# EAGLE board Flight Controller (EAGLE 8.2.2)
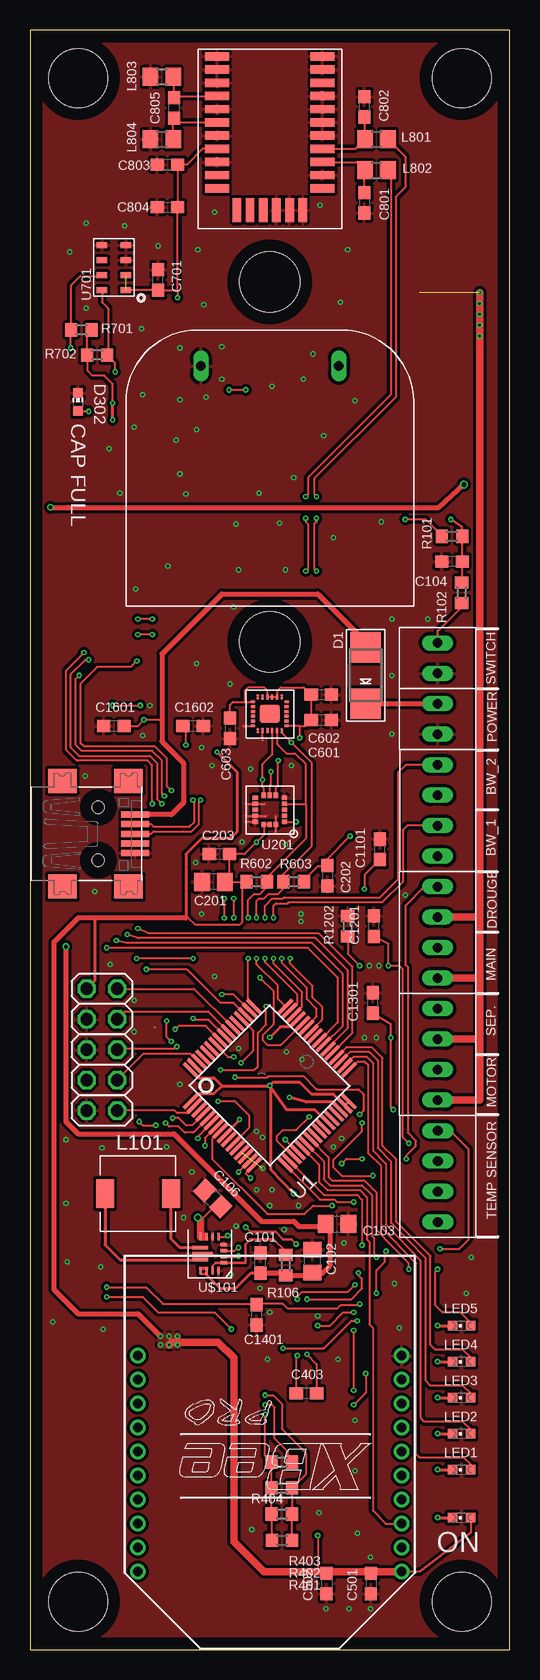
[diagram p15: board, top side]
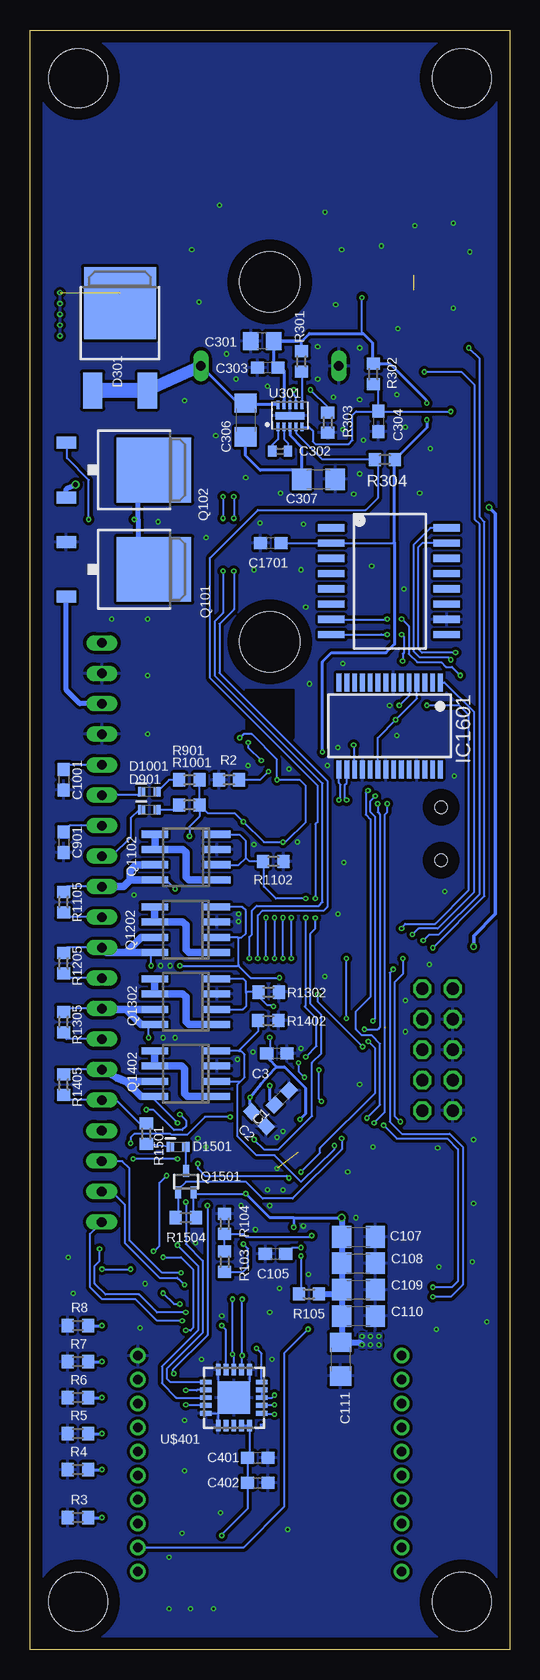
[diagram p16: board, bottom side, seen from below]

Size 40 x 135 mm. Coordinates in mm from the lower left corner, seen from the top.
Outline: 0,0 40,0 40,135 0,135 0,0
Copper layers (1*16): Top 0.035mm / dielectric 1.5mm / Bottom 0.035mm
Design rules "default *": minimum track width 7mil, minimum drill 7mil, track to track 7mil, track to pad 7mil, pad to pad 7mil, via to via 7mil, smd to smd 7mil, copper to edge 40mil, drill to drill 8mil, minimum pad ring 10mil, minimum via ring 5mil, stop-mask expansion 4mil, vias tented up to drill 0mil, thermal gap 10mil
Net classes: 0 default: clearance 0.205 mm; 1 signals: width 0.13 mm, clearance 0.205 mm
Holes 4.9 mm at 4,131 36,4 4,4 36,131
Holes 5 mm at 20,84 20,114
tKeepout: area 13,104.9 to 15.5,109.2; area 24.5,104.9 to 27,109.2
bKeepout: area 13,104.9 to 15.5,109.2; area 24.5,104.9 to 27,109.2

## Footprints (pad centres in the part's own frame; a part is rotated, then mirrored left to right if it is on the bottom)
C0603 = smd 1.1 x 1: 1 -0.85,0; 2 0.85,0
C0805 = smd 1.3 x 1.5: 1 -0.95,0; 2 0.95,0
C1206 = smd 1.6 x 1.8: 1 -1.4,0; 2 1.4,0
C0402 = smd 0.7 x 0.9: 1 -0.65,0; 2 0.65,0
AVX_1F_5V_FOLDED = drill 0.8 long: 1 -5.75,0; 2 5.75,0
USB-MINIB = smd 0.5 x 2.308: D+ 0,4.064; D- -0.8,4.064; GND 1.6,4.064; ID 0.8,4.064; VBUS -1.6,4.064 | smd 2 x 2.4: GND1 -4.4,-2; GND2 -4.4,3.5; GND3 4.4,3.5; GND4 4.4,-2 | hole 1: -2.2,1; 2.2,1
SMADIODE = smd 2.54 x 2.54: A 2.349,0; C -2.349,0
TO252 = smd 1.6 x 3: 1 -2.28,-4.8; 2 2.28,-4.8 | smd 6 x 6: 3 0,2.5
CHIP-LED0603 = smd 0.8 x 0.8: A 0,-0.75; C 0,0.75
SOD523 = smd 0.6 x 0.8: A 0.7,0; C -0.6,0
SSOP28 = smd 0.4 x 1.5: 1 -4.225,-3.625; 2 -3.575,-3.625; 3 -2.925,-3.625; 4 -2.275,-3.625; 5 -1.625,-3.625; 6 -0.975,-3.625; 7 -0.325,-3.625; 8 0.325,-3.625; 9 0.975,-3.625; 10 1.625,-3.625; 11 2.275,-3.625; 12 2.925,-3.625; 13 3.575,-3.625; 14 4.225,-3.625; 15 4.225,3.625; 16 3.575,3.625; 17 2.925,3.625; 18 2.275,3.625; 19 1.625,3.625; 20 0.975,3.625; 21 0.325,3.625; 22 -0.325,3.625; 23 -0.975,3.625; 24 -1.625,3.625; 25 -2.275,3.625; 26 -2.925,3.625; 27 -3.575,3.625; 28 -4.225,3.625
2POS_0.1 = drill 0.8 long: 1 -1.27,0; 2 1.27,0
4POS_0.1 = drill 0.8 long: 1 -3.81,0; 2 -1.27,0; 3 1.27,0; 4 3.81,0
2X05 = drill 1.016 octagon: 1 -5.08,-1.27; 2 -5.08,1.27; 3 -2.54,-1.27; 4 -2.54,1.27; 5 0,-1.27; 6 0,1.27; 7 2.54,-1.27; 8 2.54,1.27; 9 5.08,-1.27; 10 5.08,1.27
B82462G4 = smd 1.5 x 2.4: P$1 -2.75,0; P$2 2.75,0
R0805 = smd 1.3 x 1.5: 1 -0.95,0; 2 0.95,0
CHIPLED_0603 = smd 0.8 x 0.8: A 0,-0.75; C 0,0.75
TO252' = smd 1 x 1.6: 1 -2.28,-4.8; 2 2.28,-4.8 | smd 5.4 x 6.2: 3 0,2.5
SO-08 = smd 0.6 x 2.2: 1 -1.905,-2.6; 2 -0.635,-2.6; 3 0.635,-2.6; 4 1.905,-2.6; 5 1.905,2.6; 6 0.635,2.6; 7 -0.635,2.6; 8 -1.905,2.6
SOT323 = smd 0.5 x 1: 1 0,0.9; 2 -0.65,-0.9; 3 0.65,-0.9
R0603 = smd 1 x 1.1: 1 -0.85,0; 2 0.85,0
SQFP-S-10X10-64 = smd 1.6 x 0.3: 1 -5.6,3.75; 2 -5.6,3.25; 3 -5.6,2.75; 4 -5.6,2.25; 5 -5.6,1.75; 6 -5.6,1.25; 7 -5.6,0.75; 8 -5.6,0.25; 9 -5.6,-0.25; 10 -5.6,-0.75; 11 -5.6,-1.25; 12 -5.6,-1.75; 13 -5.6,-2.25; 14 -5.6,-2.75; 15 -5.6,-3.25; 16 -5.6,-3.75; 33 5.6,-3.75; 34 5.6,-3.25; 35 5.6,-2.75; 36 5.6,-2.25; 37 5.6,-1.75; 38 5.6,-1.25; 39 5.6,-0.75; 40 5.6,-0.25; 41 5.6,0.25; 42 5.6,0.75; 43 5.6,1.25; 44 5.6,1.75; 45 5.6,2.25; 46 5.6,2.75; 47 5.6,3.25; 48 5.6,3.75 | smd 0.3 x 1.6: 17 -3.75,-5.6; 18 -3.25,-5.6; 19 -2.75,-5.6; 20 -2.25,-5.6; 21 -1.75,-5.6; 22 -1.25,-5.6; 23 -0.75,-5.6; 24 -0.25,-5.6; 25 0.25,-5.6; 26 0.75,-5.6; 27 1.25,-5.6; 28 1.75,-5.6; 29 2.25,-5.6; 30 2.75,-5.6; 31 3.25,-5.6; 32 3.75,-5.6; 49 3.75,5.6; 50 3.25,5.6; 51 2.75,5.6; 52 2.25,5.6; 53 1.75,5.6; 54 1.25,5.6; 55 0.75,5.6; 56 0.25,5.6; 57 -0.25,5.6; 58 -0.75,5.6; 59 -1.25,5.6; 60 -1.75,5.6; 61 -2.25,5.6; 62 -2.75,5.6; 63 -3.25,5.6; 64 -3.75,5.6
TFLGA16L = smd 0.45 x 0.35: P1 -1.225,1; P2 -1.225,0.5; P3 -1.225,0; P4 -1.225,-0.5; P5 -1.225,-1; P9 1.225,-1; P10 1.225,-0.5; P11 1.225,0; P12 1.225,0.5; P13 1.225,1 | smd 0.35 x 0.45: P6 -0.5,-1.225; P7 0,-1.225; P8 0.5,-1.225; P14 0.5,1.225; P15 0,1.225; P16 -0.5,1.225
DFN10-2X3 = smd 0.25 x 0.7: P1 -2,-1.85; P2 -1.5,-1.85; P3 -1,-1.85; P4 -0.5,-1.85; P5 0,-1.85; P6 0,0; P7 -0.5,0; P8 -1,0; P9 -1.5,0; P10 -2,0 | smd 2.39 x 0.64: P11 -1,-0.925
QFN-24 = smd 0.4 x 0.2: 1 -1.4,1; 2 -1.4,0.6; 3 -1.4,0.2; 4 -1.4,-0.2; 5 -1.4,-0.6; 6 -1.4,-1; 13 1.4,-1; 14 1.4,-0.6; 15 1.4,-0.2; 16 1.4,0.2; 17 1.4,0.6; 18 1.4,1 | smd 0.2 x 0.4: 7 -1,-1.4; 8 -0.6,-1.4; 9 -0.2,-1.4; 10 0.2,-1.4; 11 0.6,-1.4; 12 1,-1.4; 19 1,1.4; 20 0.6,1.4; 21 0.2,1.4; 22 -0.2,1.4; 23 -0.6,1.4; 24 -1,1.4 | smd 1.7 x 1.54: PAD 0,0
MS5611 = smd 0.9 x 0.5: 1 0,0; 2 0,-1.25; 3 0,-2.5; 4 0,-3.75; 5 2,-3.75; 6 2,-2.5; 7 2,-1.25; 8 2,0
SOP16 = smd 0.6 x 2.2: 1 -4.445,-4.87; 2 -3.175,-4.87; 3 -1.905,-4.87; 4 -0.635,-4.87; 5 0.635,-4.87; 6 1.905,-4.87; 7 3.175,-4.87; 8 4.445,-4.87; 9 4.445,4.743; 10 3.175,4.743; 11 1.905,4.743; 12 0.635,4.743; 13 -0.635,4.743; 14 -1.905,4.743; 15 -3.175,4.743; 16 -4.445,4.743
VQFN15_2.5X3 = smd 0.6 x 0.25: P1 -1.15,0.75; P2 -1.15,0.25; P3 -1.15,-0.25; P4 -1.15,-0.75 | smd 0.25 x 0.6: P5 -0.725,-1.4; P6 -0.225,-1.4; P7 0.275,-1.4; P8 0.775,-1.4; P12 0.775,1.4; P13 0.27,1.4; P14 -0.225,1.4; P15 -0.725,1.4 | smd 1.35 x 0.25: P9 0.775,-0.5; P11 0.775,0.5 | smd 1.7 x 0.25: P10 0.6,0
TQFN20-5X5 = smd 0.95 x 0.4: 1 -2.325,1.3; 2 -2.325,0.65; 3 -2.325,0; 4 -2.325,-0.65; 5 -2.325,-1.3; 11 2.325,-1.3; 12 2.325,-0.65; 13 2.325,0; 14 2.325,0.65; 15 2.325,1.3 | smd 0.4 x 0.95: 6 -1.3,-2.325; 7 -0.65,-2.325; 8 0,-2.325; 9 0.65,-2.325; 10 1.3,-2.325; 16 1.3,2.325; 17 0.65,2.325; 18 0,2.325; 19 -0.65,2.325; 20 -1.3,2.325 | smd 2.7 x 2.7: EXP 0,0
M10478-A3 = smd 2 x 0.7: 1 -4.4,12.8; 2 -4.4,11.7; 3 -4.4,10.6; 4 -4.4,9.5; 5 -4.4,8.4; 6 -4.4,7.3; 7 -4.4,6.2; 8 -4.4,5.1; 9 -4.4,4; 10 -4.4,2.9; 11 -4.4,1.8; 18 4.4,1.8; 19 4.4,2.9; 20 4.4,4; 21 4.4,5.1; 22 4.4,6.2; 23 4.4,7.3; 24 4.4,8.4; 25 4.4,9.5; 26 4.4,10.6; 27 4.4,11.7; 28 4.4,12.8 | smd 0.7 x 2: 12 -2.75,0; 13 -1.65,0; 14 -0.55,0; 15 0.55,0; 16 1.65,0; 17 2.75,0
XBEE-PRO = drill 0.8 pad 1.27: 1 -11,9; 2 -11,7; 3 -11,5; 4 -11,3; 5 -11,1; 6 -11,-1; 7 -11,-3; 8 -11,-5; 9 -11,-7; 10 -11,-9; 11 11,-9; 12 11,-7; 13 11,-5; 14 11,-3; 15 11,-1; 16 11,1; 17 11,3; 18 11,5; 19 11,7; 20 11,9

## Placement (x,y rotation side)
C1  4.7u  [C0603]  19,46 45 bottom
C2  1u  [C0603]  20.9,44.2 135 bottom
C3  100n  [C0603]  19.4,49.69 180 bottom
C101  10u  [C0603]  19.21,32.22 90 top
C102  10u  [C0805]  23.55,32.37 90 top
C103  10u  [C0805]  25.61,35.47 0 top
C104  2.2 u  [C0603]  35.2,90.7 180 top
C105  100n  [C0603]  19.52,32.96 180 bottom
C106  10u  [C0805]  15.25,37.59 135 top
C107  22u  [C1206]  12.6,34.4 0 bottom
C108  22u  [C1206]  12.6,32.2 0 bottom
C109  22u  [C1206]  12.6,30 0 bottom
C110  22u  [C1206]  12.6,27.8 0 bottom
C111  22u  [C1206]  14.09,24.2 270 bottom
C201  10u  [C0805]  15.3,64 180 top
C202  0.1u  [C0603]  24.8,64.5 270 top
C203  0.1u  [C0603]  15.8,66.3 180 top
C301  2.2u  [C0805]  20.62,109.07 180 bottom
C302  1u  [C0402]  19.13,99.89 0 bottom
C303  1u  [C0603]  20.17,106.84 180 bottom
C304  0.1u  [C0603]  10.94,102.38 270 bottom
C305  [AVX_1F_5V_FOLDED]  20,107 180 top
C306  100u  [C1206]  22.02,102.49 270 bottom
C307  100u  [C1206]  15.94,97.55 0 bottom
C401  0.1 u  [C0603]  21,16 0 bottom
C402  0.1 u  [C0603]  21,13.9 0 bottom
C403  100 n  [C0603]  23.06,21.37 0 top
C501  0.1u  [C0603]  28.44,5.5 270 top
C502  1u  [C0603]  24.74,5.5 270 top
C601  0.1u  [C0603]  24.3,77.5 0 top
C602  10n  [C0603]  24.3,79.6 0 top
C603  0.1u  [C0603]  16.68,76.79 270 top
C701  100n  [C0603]  10.69,114.17 90 top
C801  22p  [C0603]  27.9,120.6 270 top
C802  22p  [C0603]  27.9,128.6 90 top
C803  22p  [C0603]  11.47,123.79 0 top
C804  2.2u  [C0603]  11.47,120.22 0 top
C805  18p  [C0603]  12,128.5 270 top
C901  0.1u  [C0603]  37.2,67.3 270 bottom
C1001  0.1u  [C0603]  37.2,72.5 270 bottom
C1101  0.1u  [C0603]  29.2,66.7 90 top
C1201  0.1u  [C0603]  28.7,60.3 90 top
C1301  0.1u  [C0603]  28.6,53.9 90 top
C1401  0.1u  [C0603]  18.9,27.9 270 top
C1601  0.1u  [C0603]  7,77 0 top
C1602  0.1u  [C0603]  13.6,77 0 top
C1701  0.1u  [C0603]  19.91,92.22 180 bottom
CN1  [USB-MINIB]  4.7,68 270 top
D1  B160-13-F  [SMADIODE]  28,81.2 90 top
D301  RB095BM-30  [TO252]  32.49,109.74 0 bottom
D302  LTST-C193KRKT-2A  [CHIP-LED0603]  4,104 0 top
D901  CES521SOD523  [SOD523]  30.1,70 0 bottom
D1001  CES521SOD523  [SOD523]  30.1,71.5 0 bottom
D1501  CES521SOD523  [SOD523]  27.7,41.9 0 bottom
IC1601  FT232RL  [SSOP28]  10,77 180 bottom
J1  2POS_SCREWTERM  [2POS_0.1]  34,77.57 270 top
J2  4POS_SCREWTERM  [4POS_0.1]  34.02,39.44 90 top
J3  4POS_SCREWTERM  [4POS_0.1]  34,49.61 90 top
J4  4POS_SCREWTERM  [4POS_0.1]  34,59.78 90 top
J5  4POS_SCREWTERM  [4POS_0.1]  34.01,69.94 90 top
J101  2POS_SCREWTERM  [2POS_0.1]  34,82.64 90 top
JP1  [2X05]  6,50 270 top
L101  B82462G4102M  [B82462G4]  9,38 0 top
L801  47n  [R0805]  28.9,125.9 0 top
L802  47n  [R0805]  28.9,123.3 0 top
L803  2.2u  [R0805]  11,131.1 0 top
L804  2.2u  [R0805]  11,125.9 0 top
LED1  BLUE  [CHIPLED_0603]  36,15 90 top
LED2  BLUE  [CHIPLED_0603]  36,18 90 top
LED3  BLUE  [CHIPLED_0603]  36,21 90 top
LED4  BLUE  [CHIPLED_0603]  36,24 90 top
LED5  BLUE  [CHIPLED_0603]  36,27 90 top
ON  RED  [CHIPLED_0603]  36,11 90 top
Q101  IPD042P03L3G  [TO252']  32.16,90.05 270 bottom
Q102  IPD042P03L3G  [TO252']  32.16,98.32 270 bottom
Q1102  DMG4800LSD  [SO-08]  26.98,66.05 90 bottom
Q1202  DMG4800LSD  [SO-08]  27,60 90 bottom
Q1302  DMG4800LSD  [SO-08]  27,54 90 bottom
Q1402  DMG4800LSD  [SO-08]  27,48 90 bottom
Q1501  PMF170XP  [SOT323]  27,39 0 bottom
R2  10k  [R0603]  23.4,72.5 0 bottom
R3  [R0603]  36,11 0 bottom
R4  [R0603]  36,15 0 bottom
R5  [R0603]  36,18 0 bottom
R6  [R0603]  36,21 0 bottom
R7  [R0603]  36,24 0 bottom
R8  [R0603]  36,27 0 bottom
R101  100k  [R0603]  35.2,92.8 180 top
R102  1k  [R0603]  36,88.1 270 top
R103  470k  [R0603]  23.76,32.32 270 bottom
R104  150k  [R0603]  23.76,35.48 270 bottom
R105  100k  [R0603]  16.73,29.64 0 bottom
R106  10k  [R0603]  21.34,32.03 270 top
R301  10k  [R0603]  17.36,107.37 90 bottom
R302  2.2k  [R0603]  11.36,106.32 90 bottom
R303  12k  [R0603]  15.16,102.27 90 bottom
R304  10k  [R0603]  10.4,99.2 0 bottom
R401  1.2 k  [R0603]  21.02,9.1 180 top
R402  1.2 k  [R0603]  21.01,11.3 180 top
R403  1.2 k  [R0603]  21.01,13.47 180 top
R404  10 M  [R0603]  21.01,15.62 180 top
R602  2.2K  [R0603]  18.9,64 180 top
R603  2.2K  [R0603]  22,64 0 top
R701  2.2k  [R0603]  4.3,110 0 top
R702  2.2k  [R0603]  5.6,107.9 180 top
R901  10k  [R0603]  26.7,70.4 0 bottom
R1001  10k  [R0603]  26.7,72.5 0 bottom
R1102  10 k  [R0603]  19.7,65.7 180 bottom
R1105  1M  [R0603]  37.2,62.3 270 bottom
R1202  10 k  [R0603]  26.5,60.3 270 top
R1205  1M  [R0603]  37.2,57.2 270 bottom
R1302  10 k  [R0603]  20.1,54.8 180 bottom
R1305  1M  [R0603]  37.2,52.3 270 bottom
R1402  10 k  [R0603]  20.11,52.43 180 bottom
R1405  1M  [R0603]  37.2,47.1 270 bottom
R1501  10 k  [R0603]  30.3,43 270 bottom
R1504  10 k  [R0603]  27,36 0 bottom
U1  G55J19  [SQFP-S-10X10-64]  20,47 45 top
U201  HDLIS100DL  [TFLGA16L]  20,70 180 top
U301  LTC3225  [DFN10-2X3]  17.31,103.76 0 bottom
U601  MPU9250  [QFN-24]  20,78 180 top
U701  MS5611  [MS5611]  8,113.3 180 top
U1701  MT29F1G01  [SOP16]  9.99,89.05 270 bottom
U$101  TPS6307X  [VQFN15_2.5X3]  15,33 180 top
U$401  MAX31865  [TQFN20-5X5]  23,21 180 bottom
U$801  [M10478-A3]  20,120 0 top
XB501  XBEE-PRO  [XBEE-PRO]  20,15.5 180 top

## Tracks (layer width: path | path; a pad name or v marks a point on that pad's centre or on a via)
+3V3  (via drill 0.18, 0.4)  (1 unrouted)
  Top 0.152: C106.1 15.44,36.99 14.22,35.77
  Top 0.178: 23,77 23.45,77.45 C601.1
  Top 0.18: U$801.8 14.4,125.1 13.09,123.79 C803.2 C804.2 12.3,120.2 12.3,113.3 | U201.P15 U201.P14 19.5,67.9 v18.9,67.3 17.9,66.3 C203.1 16.65,64.4 C201.1 R602.2 17.67,63.62 17.67,60.6 17.47,60.4 13.8,60.4 13.2,61 12.98,61 | U201.P1 v22.2,69 | 22.47,77 23,77 | 22.47,77 U601.1 | U601.22 20.2,74.6 19.4,73.8 v19.4,72.5 19.4,71.9 19.5,71.8 U201.P8 | 17.93,79 U601.13 | 12.3,113.3 v12.3,112.7 | C601.1 C602.1 22.85,80.2 20.9,80.2 20.6,79.9 U601.8 U601.9 U601.10 19.8,79.95 19.55,80.2 18.2,80.2 17.9,79.9 17.9,79.03 17.93,79 | v22.5,76 22.5,76.97 22.47,77 | C603.1 16.68,78.75 16.93,79 17.93,79 | ON.A 36.75,9.75 32.5,6.5 XB501.1 | C502.1 24.89,6.5 | C501.1 28.29,6.5 | R603.2 22.85,64.15 24,65.3 24.75,65.3 C202.1 24.8,65.9 v26.7,67.8 | v24,9.5 24,6.61 24.11,6.5 | U701.1 10.67,113.3 C701.1 12.28,113.32 12.3,113.3 | R701.2 4.75,109.6 R702.2 4.8,107.85 4.8,106.6 5.2,106.2 6.2,106.2 6.9,105.5 v6.9,103.9
  Top 0.203: v22.2,33.8 21.8,34.2 21.1,34.2 20.5,34.8 18.4,34.8 v18,35.2
  Top 0.254: U$101.P8 U$101.P7 14.72,34.5 14.22,35 | 24.84,43.94 U1.27 24.83,43.92 23.77,44.98 21.42,44.98 20.07,46.9 | U1.32 U1.31 25.32,46.28 23.51,46.28 22.5,47.29 20.29,47.29 v20,47 | U1.64 13.41,48.31 14.06,47.66 15.34,47.66 16,47 | 16,47 v20,47 | U1.1 13.41,45.69 14.06,46.34 15.34,46.34 16,47 | 20.07,46.9 v20,47 | v22,38 20.1,40 20.1,46.87 20.07,46.9 | v14,36 14.22,36 | v6.9,102.5 v6.9,103.9 | v15.6,74.8 17.3,73.1 17.3,68.2 16.7,67.6 14.3,67.6 13,66.3 13,61.02 12.98,61 | 5.35,61 5.4,60.95 5.4,55.75 JP1.1
  Top 0.406: 13.02,61 12.98,61 5.35,61 4,61 2,59 2,30 4,28 9,28 v10.9,26.1
  Top 0.61: XB501.1 28.29,6.5 24.89,6.5 24.11,6.5 19.5,6.5 17,9 17,24.3 15.7,25.6 11.8,25.6 v11.6,25.4 | U$101.P8 14.22,35 14.22,35.77 v14,36
  Bottom 0.18: 6.9,104.1 v6.9,103.9 | R1504.2 26.35,36.2 Q1501.3 26.25,38 v22,38 | 12.2,109.7 12.3,109.8 v12.3,112.7 | v22.5,76 22.2,76.3 21.5,76.3 19.4,74.2 v19.4,72.5 17.5,72.5 17,72 17,69 18.7,67.3 v18.9,67.3 20.5,67.3 v22.2,69 22.9,69.7 25.15,69.7 R901.2 | C1701.1 U1701.2 9.65,92.22 9.6,92.27 | R901.2 R1001.2 | R103.2 22.23,31.47 21.8,31.9 21.8,33.4 v22.2,33.8 | U$401.19 U$401.20 | U$401.20 21.68,18.68 | U$401.20 21.7,16.15 C401.1 C402.1 21.85,11.75 24,9.6 v24,9.5 | R901.2 25.85,69.45 26.7,68.6 v26.7,67.8
  Bottom 0.203: v18,35.2 18,35.99 18.01,36
  Bottom 0.254: v20,47 20,45.8 C1.1 | v14,36 18.01,36 20,36 v22,38 | C301.1 19.67,107.19 C303.1 19.06,106.84 18.81,106.59 U301.P9 | C301.1 17.61,109.07 | R301.2 17.36,108.82 17.36,109.07 | 17.36,109.07 C301.1 | 17.36,109.07 17.33,109.07 16.7,109.7 12.2,109.7 11.4,108.9 11.4,107.21 R302.2 9.97,107.17 6.9,104.1 | v6.9,102.5 6.9,101.85 R304.2 9.6,99.15 9.6,92.27 9.6,83.8 10.3,83.1 14.85,83.1 15.6,82.35 v15.6,74.8 | JP1.1 4.73,55.13
  Bottom 0.508: v14,36 C107.1 C108.1 C109.1 14,29.68 | 14,29.68 C110.1 14,25.69 C111.1 12.5,25.6 v12.3,25.4 | R105.2 14.04,29.64 14,29.68
  other vias: 11.6,26.1 12.3,26.1 10.9,25.4
  pour Top: 10.6,26.4 10.6,25.1 12.6,25.1 12.6,26.4
  pour Bottom: 12.6,26.4 12.6,25.1 10.6,25.1 10.6,26.4
+5V  (via drill 0.18)
  Top 0.178: C1601.2 9,77 v9.5,77.5
  Top 0.18: v9.5,77.5 10.96,77.5 11,77.47
  Top 0.406: CN1.VBUS 11.8,69.6 12.8,70.6 12.8,73.9 11,75.7 11,77.47 11,83 16,88 24,88 28,84 D1.A
  Bottom 0.178: IC1601.20 11,73.4 11,76 v9.5,77.5 7.72,79.28 IC1601.4
  Bottom 0.18: 11,73.35 IC1601.20
BREAKWIRE1:N$1
  Bottom 0.18: R901.1 27.95,70 D901.A
BREAKWIRE2:N$1
  Bottom 0.18: R1001.1 28.4,72.5 D1001.A
BW1_STATUS  (via drill 0.18)
  Top 0.18: U1.46 22.7,53.59 22.7,54.8 20.3,57.2 v20.3,57.6 | J5.2 31.47,68.67 31.1,68.3 31.1,64 29.4,62.3 21.6,62.3 21.5,62.2 20.5,62.2 20.3,62 v20.3,61
  Bottom 0.18: J5.2 36.68,68.67 C901.1 | v20.3,57.6 v20.3,61
BW2_STATUS  (via drill 0.18)
  Top 0.18: U1.47 22.3,53.9 22.3,54.6 19.6,57.3 v19.6,57.6 | J5.4 31.35,73.75 30.7,73.1 30.7,64.2 29.2,62.7 21.2,62.7 21.1,62.6 20.2,62.6 19.6,62 v19.6,61
  Bottom 0.18: J5.4 36.8,73.75 C1001.1 | v19.6,61 v19.6,57.6
C4:N$2
  Bottom 0.18: Q1501.1 D1501.A
C4:N$3
  Bottom 0.18: D1501.C 30.25,42.1 R1501.2
DCDC_REGULATOR:N$1  (via drill 0.18)
  Top 0.18: R101.2 34.35,92.85 33,94.2 v31.3,94.2
  Bottom 0.18: 31,95.88 Q102.3 | 31,92.39 Q101.3 | v31.3,94.2 31.02,94.2 31,94.22
  Bottom 0.406: 31,95.88 31,94.22 31,92.39
DCDC_REGULATOR:N$3
  Top 0.254: U$101.P11 7.5,32.5 6.25,33.75 L101.P$1
DCDC_REGULATOR:N$4  (via drill 0.18)
  Top 0.18: R102.1 36.05,89 C104.1 R101.1 36.05,93.55 v35.1,94.2
  Bottom 0.18: Q102.1 36.9,100.54 36.9,99.3 35.1,97.5 v35.1,94.2
DCDC_REGULATOR:N$5
  Top 0.254: L101.P$2 11.75,34.25 12.5,33.5 U$101.P9
DCDC_REGULATOR:N$6
  Top 0.18: J101.2 34,84.9 36,86.9 R102.2
DCDC_REGULATOR:N$7  (via drill 0.18)
  Top 0.18: U$101.P3 17.05,33.25 17.3,33.5 v17.4,33.5
  Bottom 0.18: v17.4,33.5 18.13,33.5 C105.1
DCDC_REGULATOR:N$9  (via drill 0.18)
  Top 0.18: U$101.P2 17.35,32.75 v17.4,32.8
  Bottom 0.18: v17.4,32.8 17.4,29.76 R105.1
DCDC_REGULATOR:N$10  (via drill 0.18)
  Top 0.18: U$101.P5 16.4,34.4 v16.5,34.5
  Bottom 0.18: R103.1 R104.2 22.23,34.63 22,34.4 16.6,34.4 v16.5,34.5
DCDC_REGULATOR:N$11
  Top 0.203: 20.32,34.2 21.34,33.18 R106.1
  Top 0.21: U$101.P14 15.22,31.98 15.49,32.25 U$101.P1 17.96,32.25 17.96,33.79 18.37,34.2 20.32,34.2
DCDC_REGULATOR:VIN  (via drill 0.3, 0.4)
  Top 0.18: 14.25,31.32 14.63,31.32 14.73,31.42 U$101.P13 | 14.25,31.32 14.22,31.32 | U$101.P12 14.22,31.35 14.25,31.32
  Top 0.254: C101.1 18.41,31.37 17.11,30.07 15.88,30.07 14.63,31.32
  Top 0.406: C101.1 20.93,31.37 R106.2 23.31,31.18 C102.1 | C102.1 23.19,31.38 | C102.1 24.32,31.32 25,32 25,35.17 24.96,35.17 24.87,35.26 | 24.54,35.63 C103.1 24.87,35.26 | v36.2,97.1 34.1,95.2 3.2,95.2 v1.7,95.2 | v3,58.6 3,44 4,43 12,43 19.3,35.7 22,35.7 22.44,35.26 24.87,35.26
  Bottom 0.305: v3,58.6 3,59.5 1.2,61.3 1.2,94.7 v1.7,95.2
  Bottom 0.406: Q102.2 36.96,96.76 36.9,96.8 v36.2,97.1
FC1-  (via drill 0.18)
  Top 0.18: v27.7,43.9 27.7,43.2 25.3,40.8 25.3,40.2 26,39.5 v28.6,39.5 | U1.56 16.22,51.18 14.9,52.5 13.7,52.5 v13.6,52.6 | v13.6,57.6 v8.9,57.6 | v9.1,44 9.4,43.7 v10.5,43.7 | v6.4,30.2 9.7,30.2 11.1,28.8 18.85,28.8 C1401.1 18.95,28.8 21.1,28.8 21.5,28.4 25.6,28.4 25.9,28.7 27.4,28.7 v27.5,28.8 | v28.9,29.7 28.9,31.6 29.6,32.3 29.6,33.1 v29.7,33.2
  Bottom 0.18: J3.2 36.95,48.34 37.2,48.09 | Q1402.8 29.6,45.8 v27.7,43.9 | v8.9,57.6 8.9,56.3 9.6,55.6 9.6,44.5 v9.1,44 | v13.6,52.6 v13.6,57.6 | v10.5,43.7 9.4,42.6 5.2,42.6 4.3,41.7 4.3,30.7 4.8,30.2 v6.4,30.2 | v27.5,28.8 28,28.8 v28.9,29.7 | v28.6,39.5 29.2,38.9 29.2,33.66 29.66,33.2 v29.7,33.2
  Bottom 0.2: 37.2,48.09 R1405.1
  Bottom 0.61: 32,47.37 Q1402.7 | 32,47.37 32.73,47.66 J3.2 | Q1402.8 30.73,46.09 32,47.37
FC1_FIRE  (via drill 0.18)
  Top 0.18: U1.7 14.6,42.66 v14.6,42
  Bottom 0.18: Q1402.2 22.43,47.37 | 22.43,47.37 22.1,47.7 22.1,49.6 22.4,49.9 22.6,49.9 | 22.6,49.9 Q1402.4 | 22.43,47.37 22.7,47.1 22.7,42.78 21.12,41.2 19.6,41.2 17.4,39 14.6,41.7 v14.6,42 | 22.6,49.9 20.96,51.54 R1402.2
FC2-  (via drill 0.18)
  Top 0.18: C1301.1 30.1,52.15 v30.1,51 30.1,45.2 v30.3,45 | U1.52 17.65,52.55 18.6,51.6 18.6,49.9 v17.6,48.9 | v17.1,47.7 19.8,47.7 19.9,47.8 22.8,47.8 23.9,46.7 27.4,46.7 27.8,46.3 27.8,44.9 v27.5,44.6
  Bottom 0.18: J3.4 36.95,53.42 | v30.1,51 v30.11,51.01 30.11,52.09 | v17.6,48.9 17.6,48.2 v17.1,47.7 | v27.5,44.6 27,44.1 27,43.6 27.3,43.3 28,43.3 29.7,45 v30.3,45
  Bottom 0.2: 36.95,53.42 37.2,53.17 R1305.1
  Bottom 0.61: 32,53.37 Q1302.7 | 32,53.37 33.95,53.37 J3.4 | Q1302.8 30.11,52.09 30.73,52.09 32,53.37
FC2_FIRE  (via drill 0.18)
  Top 0.18: U1.11 18.3,43.53 18.3,44.5 17.1,45.7 v15.7,45.7 | v19.7,53.6 19.7,52.1 19,51.4 19,48.6 18.7,48.3 v15.9,48.3
  Bottom 0.18: Q1302.2 22.23,53.37 22,53.6 22,54.74 | 22,54.74 22,55.7 22.2,55.9 Q1302.4 | 22,54.74 21.94,54.8 R1302.2 20.95,54.45 20.2,53.7 19.8,53.7 v19.7,53.6 | v15.7,45.7 15.9,45.9 v15.9,48.3
FC3-  (via drill 0.18)
  Top 0.18: C1201.1 29.9,58.85 v29.9,57 30.8,57 31.1,56.7 31.1,42.7 v31.6,42.2 | U1.19 21.94,41.1 21.32,41.71 21.29,41.71 20.6,42.4 20.6,42.8 21.1,43.3 22.2,43.3 v23.3,44.4
  Bottom 0.18: J4.2 36.95,58.51 37.2,58.26 | v29.9,57 v29.89,57.01 29.89,58.09 | v23.3,44.4 25.4,44.4 26.9,42.9 28.2,42.9 28.3,43 31.3,43 31.6,42.7 v31.6,42.2
  Bottom 0.2: 37.2,58.26 R1205.1
  Bottom 0.61: 32,58.09 29.89,58.09 Q1202.8 | 32,58.09 33.59,58.09 J4.2 | Q1202.7 30.73,59.37 32,58.09
FC3_FIRE  (via drill 0.18)
  Top 0.18: v19.2,56 20.3,54.9 20.3,52.1 19.4,51.2 19.4,50.8 19.8,50.4 20.93,50.4 U1.44 | R1202.2 26.5,58 v27.5,57
  Bottom 0.18: 22.66,59.37 22.34,59.37 22,59.7 22,61.6 22.3,61.9 Q1202.4 | 22.66,59.37 Q1202.2 | 22.66,59.37 22.6,59.3 22.6,57.07 | 22.6,57.07 22.6,57 21.6,56 v19.2,56 | v27.5,57 22.67,57 22.6,57.07
FC4-  (via drill 0.18)
  Top 0.18: C1101.1 27.9,64.55 v27.9,63.4 | J4.4 32.89,63.59 31.3,62 31.3,57.1 31.5,56.9 31.5,43.1 32.2,42.4 32.2,42 31.4,41.2 v31.4,40.9 | U1.16 17.99,39.71 v18.4,39.3 | v26,40.5 26.4,40.9 v27.7,40.9
  Bottom 0.18: J4.4 36.95,63.59 37.2,63.34 | v27.9,63.4 28.64,64.14 Q1102.8 | v26,40.5 26,40.1 25.4,39.5 18.6,39.5 v18.4,39.3 | v27.7,40.9 v31.4,40.9
  Bottom 0.2: 37.2,63.34 R1105.1
  Bottom 0.61: 31.66,64.14 32.2,63.6 J4.4 | Q1102.8 31.66,64.14 | Q1102.7 31.18,65.42 31.66,64.94 31.66,64.14
FC4_FIRE  (via drill 0.18)
  Top 0.18: U1.58 16.54,49.4 v17,49.4 | v17,61 v17,62.6
  Bottom 0.18: Q1102.2 22.59,65.42 22,66 | 22,66 22,67.4 22.5,67.9 24.32,67.9 Q1102.4 | 22,66 21.7,65.7 R1102.2 20.5,65.65 20.5,63.6 19.5,62.6 v17,62.6 | v17,49.4 16.1,50.3 16.1,52.6 17.1,53.6 17,53.7 v17,61
FC_!CONT_EN  (via drill 0.18)
  Top 0.18: U1.6 14,42.77 v14,42.6
  Bottom 0.18: R1504.1 27.65,36.2 Q1501.2 27.65,38.35 27,39 22,39 20.6,37.6 18.1,37.6 14,41.7 v14,42.6
FIRING_CIRCUIT1:N$1
  Bottom 0.61: Q1402.1 26.85,46.1 27.1,46.35 27.1,48.38 27.35,48.63 Q1402.6 Q1402.5
FIRING_CIRCUIT2:N$1
  Bottom 0.61: Q1302.1 26.75,52.09 27,52.35 27,54.38 27.25,54.63 Q1302.6 Q1302.5
FIRING_CIRCUIT3:N$1
  Bottom 0.61: Q1202.1 26.75,58.09 27,58.35 27,60.38 27.25,60.63 Q1202.6 Q1202.5
FIRING_CIRCUIT4:N$1
  Bottom 0.61: Q1102.1 26.75,64.14 27,64.4 27,66.43 27.25,66.69 Q1102.6 Q1102.5
FT1:N$5  (via drill 0.18)
  Top 0.18: v13,75.4 13,76.85 C1602.1
  Bottom 0.18: IC1601.17 12.93,75.33 v13,75.4
GND  (via drill 0.18)  (1 unrouted)
  Top 0.18: 17.8,77 U601.18 | 19.4,75.8 U601.20 | U201.P13 18,69 | 20.5,68 U201.P16 20.5,69.5 | 19.6,70.5 U201.P10 18,70.5 18,69.5 U201.P12 19.7,69.5
  Bottom 0.18: 24.3,19.7 U$401.EXP | 24.3,19.7 U$401.16 | U$401.15 24.3,19.7 | U$401.10 24.3,22.3 24,22 | U$401.6 21.7,22.3 21.8,22.2
  other vias: 16.77,31.28 17.2,35.3 21.2,35 22.7,49.2 22.6,60.7 22.6,61.3 21.3,67.1 13.8,65.6 14.3,61.3 14.3,75.2 10,78.7 9.4,76.2 13.9,82.2 16.7,80.5 30.2,76.3 30.2,81.2 30.2,85.9 33.2,85.9 17,86.9 17.4,90 21.3,90 17.2,93.8 20.8,93.9 25.3,92.7 29.3,94 20.2,105.3 22.8,105.9 23.6,108 16,108.6 16,105.9 14.7,104.4 12.5,104.2 12.5,108.5 13.9,101.7 12.2,100.8 8.7,101.9 9.4,104.6 24.2,120.4 26.5,116.7 25.9,112.3 15.4,119.8 14,116.7 14.5,112.1 27.1,104.1 24.5,101.2 22,97.7 19.1,96.4 12.5,98 13,96.3 6.6,100.1 7.5,96.4 11.5,90.3 8.8,88.4 4.6,72.8 5.4,63.2 6.7,57.1 15.4,56.1 19.4,42.7 21.4,49.8 17.4,50.1 20,37 22.4,37 13.5,39.8 11.4,41.9 6,41.8 3,42.5 20,28.1 24,27.8 19.2,30.1 12.8,36 12.5,47.1 8.7,51.5 8.7,54.1 27.1,19.1 25.7,24.2 30.8,26.8 30.4,30.5 36.8,32.7 36.4,29.7 19.8,24.2 27.3,9.7 27.1,14.9 24.1,11.4 18.5,10 28.4,7.7 26.6,3.4 24.7,3.4 28.4,3.4 5.9,31.9 3.1,32.3 3,37.2 6.1,26.7 1.9,27.3 26.2,33.9 25.3,41.9 20.2,38.3 18.9,38.3 31.3,62.9 28.3,57 27.9,51 28.9,51 29.1,57 4.7,111.8 10.7,117 7.9,118.7 4.7,118.9 3.3,116.5 9.3,110.1 18.4,73.4 15.2,73.7 21.8,73.7 17.7,67.3 26,42.6 19.4,40.1 18.9,43.2
  pour Bottom (isolate 0.254): 0,0 40,0 40,135 0,135
  pour Top (isolate 0.254): 40,0 0,0 0,135 40,135
GPS1:N$1
  Top 0.18: U$801.4 12,129.5 C805.1 12,131.1 L803.2
GPS1:N$2
  Top 0.18: U$801.21 27.15,125.1 L801.1 27.9,125.95 C802.1
GPS1:N$3
  Top 0.18: U$801.20 27.25,124 27.9,123.35 | 27.9,123.35 L802.1 | C801.1 27.9,123.34 27.9,123.35
GPS1:N$4
  Top 0.18: U$801.6 12,127.3 C805.2 11.95,127.65 L804.2
GPS_RX  (via drill 0.18)
  Top 0.18: L801.2 31.3,124.45 31.3,121.9 30.5,121.1 30.5,104.4 23.7,97.6 23.7,96.3 v23.9,96.1 | U1.42 23.39,51.53 24.39,52.52 24.39,53.56 23.57,54.37 23.57,55.32 21.7,57.19 v21.7,57.6 | v23.9,94.3 23.9,94 23.7,93.8 23.7,90.1 v23.9,89.9
  Bottom 0.18: v21.7,57.6 21.7,59.4 21.5,59.6 21.5,61.6 21.1,62 15.9,62 15.6,62.3 15.6,72.2 24.6,81.2 24.6,85.7 23.9,86.4 v23.9,89.9 | v23.9,96.1 v23.9,94.3
GPS_TX  (via drill 0.18)
  Top 0.18: L802.2 30.1,123.05 30.1,104.6 23.2,97.7 23.2,96.3 v23,96.1 | U1.43 23.9,52.77 23.9,53.4 23.09,54.22 23.09,55.16 21,57.24 v21,57.6 | v23,94.3 23,94 23.2,93.8 23.2,90.1 v23,89.9
  Bottom 0.18: v23,96.1 v23,94.3 | v21,57.6 21,61.2 20.6,61.6 15.5,61.6 15.2,61.9 15.2,72.4 24.2,81.4 24.2,85.5 23,86.7 v23,89.9
IMU_SCL  (via drill 0.18)
  Top 0.152: R602.1 19.7,63.95 | 22.96,70.5 23,70.46
  Top 0.18: U601.23 20.6,75.5 21.4,74.7 22.1,74.7 23,73.8 23,70.46 23,67.6 19.75,64.35 R602.1 19.75,63.55 19.2,63 18.7,63 18.2,62.5 v18.2,61 | U201.P4 22.96,70.5 | U1.49 18.2,54.1 v18.2,57.6
  Bottom 0.18: v18.2,57.6 v18.2,61
IMU_SDA  (via drill 0.18)
  Top 0.18: U601.24 21,76.4 v21.8,75.6 23.5,73.9 23.5,67 21.15,64.65 R603.1 21.1,63.95 21.1,63.4 20.7,63 19.9,63 19.5,62.6 19.1,62.6 18.9,62.4 v18.9,61 | U201.P6 20.5,71.8 20.7,72 v20.7,74.1 | U1.48 20.68,54.23 20.68,55.34 18.9,57.12 v18.9,57.6
  Bottom 0.18: v18.9,57.6 v18.9,61 | v21.8,75.6 21.8,75.2 v20.7,74.1
MEM_!CS  (via drill 0.18)
  Top 0.18: v10.2,85.9 v9,85.9 | U1.15 v17.4,39.8 | v11.78,50.69 11.4,51.07 v11.4,52.4 | v11.2,71.14 11,71.34 11,74.1 10.2,74.9 4.3,74.9 3.8,75.4 3.8,80.9 v4.1,81.2
  Bottom 0.18: v10.2,85.9 10.22,85.88 U1701.7 | v9,85.9 8.4,85.3 8.4,83 7.7,82.3 5.7,82.3 5.3,81.9 4.8,81.9 v4.1,81.2 | v17.4,39.8 15.8,41.4 15.8,41.8 11.2,46.4 11.2,50.1 v11.78,50.69 | v11.4,52.4 11.2,52.6 11.2,69.4 11.6,69.8 11.6,70.74 v11.2,71.14
MEM_MISO  (via drill 0.18)
  Top 0.18: v10.2,84.6 v9,84.6 | U1.4 13.52,43.7 13,43.7 12.4,44.3 v11.9,44.3 | v8.91,82.4 8.41,81.9 5.6,81.9 4.2,80.5 4.2,75.6 4.5,75.3 10.4,75.3 11.4,74.3 11.4,72 v11.8,71.6
  Bottom 0.18: U1701.8 10.71,84.61 v10.2,84.6 | v9,84.6 8.8,84.4 8.8,83.1 8.91,82.99 v8.91,82.4 | v11.9,44.3 10.8,45.4 10.8,50.5 11.5,51.2 12.3,51.2 12.8,51.7 12.8,53.2 11.6,54.4 11.6,69.2 12,69.6 12,71.4 v11.8,71.6
MEM_MOSI  (via drill 0.18)  (1 unrouted)
  Top 0.18: U1.5 13.62,43.1 12.9,43.1 12.4,43.6 11.6,43.6 v11.3,43.9 | v4.5,83.1 3,81.6 3,75 3.9,74.1 9.8,74.1 10.2,73.7 v10.2,70.5
  Bottom 0.18: U1701.15 7.28,92.22 7.6,91.9 7.6,83.4 7.3,83.1 v4.5,83.1 | v11.3,43.9 10.4,44.8 10.4,51.9 | v10.2,70.5 10.2,69.8 10.4,69.6 10.4,51.8
MEM_SCK  (via drill 0.18)
  Top 0.18: U1.57 14.65,52 12.4,52 v12.1,51.7 | v11,70.5 10.6,70.9 10.6,73.9 10,74.5 4.1,74.5 3.4,75.2 3.4,81.3 4.6,82.5 v4.9,82.5
  Bottom 0.18: U1701.16 6.61,93.5 8,92.1 8,83.2 7.5,82.7 5.1,82.7 v4.9,82.5 | v12.1,51.7 11,51.7 10.8,51.9 10.8,69.6 11,69.8 v11,70.5
MS5611_SCL  (via drill 0.18)
  Top 0.18: U1.39 24.53,50.43 26.1,52 26.1,56.3 23.5,58.9 8,58.9 v7.2,59.1 | v7.1,106.5 7.1,107.25 R702.1 6.5,107.95 6.5,111.8 6,112.3 U701.8
  Bottom 0.18: v7.2,59.1 6.7,59.6 5.9,59.6 2.5,63 2.5,93.8 2.9,94.2 2.9,105.4 4,106.5 v7.1,106.5
MS5611_SDA  (via drill 0.18)
  Top 0.18: U1.40 24.18,50.78 25.7,52.3 25.7,56 23.2,58.5 v6.4,58.5 | v3.4,108.5 3.4,109.95 R701.1 3.45,113.75 4.2,114.5 5.95,114.5 U701.7
  Bottom 0.18: v6.4,58.5 2.1,62.8 2.1,94 2.5,94.4 2.5,107.6 v3.4,108.5
N$1
  Top 0.18: JP1.2 13.69,55.08 U1.54
N$2
  Top 0.18: U1.55 15.52,52.54 14.86,53.2 7.93,53.2 JP1.4
N$3  (via drill 0.18)
  Top 0.178: 18.26,53.26 U1.50
  Top 0.18: JP1.6 7.37,50.1 12.1,50.1 v12.25,50.25 | U1.50 17,54.6 v16,54.6
  Bottom 0.18: v16,54.6 16,54 v12.25,50.25
N$4
  Top 0.178: U1.62 14.02,49.02
  Top 0.18: 14.02,49.02 13.4,49.63 9.44,49.63 JP1.8
N$5
  Top 0.18: U1.2 13.13,44.73 13.05,44.73 12.28,44.73 12.08,44.92 JP1.10
N$6  (via drill 0.18)
  Top 0.18: v21.1,25.1 22.88,25.1 22.89,25.11 24.51,25.11 26.8,27.4 v27.3,27.4
  Bottom 0.18: U$401.5 20.68,24.68 v21.1,25.1 | v27.3,27.4 29.4,27.4 31.2,29.2 34,29.2 35,30.2 35,34.65 J2.1
N$7  (via drill 0.18)
  Top 0.18: C403.1 22.21,24.41 v22.3,24.5 | v22.3,29.2 22.3,29.4 22.7,29.8 26.5,29.8 v27.1,30.4
  Bottom 0.18: U$401.7 22.3,23.38 v22.3,24.5 v22.3,29.2 | v27.1,30.4 27.59,30.89 27.61,30.89 27.72,31 29.2,31 32.1,33.9 32.1,37.1 33.17,38.17 J2.2
N$8  (via drill 0.18)
  Top 0.18: v23.1,24.6 23.91,23.79 C403.2 | v23.1,29.2 26.8,29.2 27.7,30.1 27.7,30.9 27.4,31.2 v27.4,31.4
  Bottom 0.18: U$401.8 23,24.5 v23.1,24.6 v23.1,29.2 | J2.3 32.3,40.7 31.7,40.1 31.7,34.1 29,31.4 v27.4,31.4
N$9  (via drill 0.18)
  Top 0.18: v24,27 25,27 26.1,28.1 v27,28.1 | v34.2,33.4 35.8,33.4 36.6,34.2 36.6,41.7 35.05,43.25 J2.4
  Bottom 0.18: U$401.9 23.65,26.65 v24,27 | v27,28.1 29.4,28.1 30.9,29.6 33.7,29.6 34.6,30.5 34.6,32 34.2,32.4 v34.2,33.4
N$10
  cutout Top: 18,80 18,76 22,76 22,80
  cutout Bottom: 22,80 22,76 18,76 18,80
N$11
  Bottom 0.18: D1001.C 30.99,71.21 J5.3
N$13
  Bottom 0.18: D901.C 30.9,70 31.6,69.3 31.6,67.7 33.17,66.13 J5.1
N$15  (via drill 0.18)
  Top 0.18: U201.P7 20,72 20.1,72.1 v20.1,73.2
  Bottom 0.18: v20.1,73.2 20.8,72.5 R2.2
N$24  (via drill 0.18)
  Top 0.254: v34,15 LED1.C
  Bottom 0.254: R4.2 v34,15
N$25  (via drill 0.18)
  Top 0.254: v34,18 LED2.C
  Bottom 0.254: R5.2 v34,18
N$26  (via drill 0.18)
  Top 0.254: v34,21 LED3.C
  Bottom 0.254: R6.2 v34,21
N$27  (via drill 0.18)
  Top 0.254: v34,24 LED4.C
  Bottom 0.254: R7.2 v34,24
N$28  (via drill 0.18)
  Top 0.254: v34,27 LED5.C
  Bottom 0.254: R8.2 v34,27
N$30  (via drill 0.18)
  Top 0.254: v34,11 ON.C
  Bottom 0.254: R3.2 v34,11
ORD+  (via drill 0.18)  (1 unrouted)
  Top 0.61: J4.3 37.5,61.05 | 37.5,61.05 v37.5,109.5 v37.5,110.4 v37.5,111.3 | v37.5,111.3 37.5,111.4 | v37.5,111.3 v37.5,112.2 v37.5,113.1 | 37.5,56.15 37.5,50.88 | 37.5,56.15 37.5,61.05 | 37.5,50.88 37.5,45.8 J3.1 | J3.3 37.5,50.88 | J4.1 37.32,55.97 37.5,56.15
  Bottom 0.18: 37.2,46.05 36.95,45.8 J3.1 32.8,45.8 30.85,43.85 R1501.1 | J3.3 36.95,50.88 37.2,51.13 | J4.1 36.95,55.97 37.2,56.22 | J4.3 36.95,61.05 37.2,61.3
  Bottom 0.2: 37.2,46.05 R1405.2 | 37.2,51.13 R1305.2 | 37.2,56.22 R1205.2 | 37.2,61.3 R1105.2
  Bottom 0.61: 32.49,113.1 D301.3
  pour Bottom (rank 2, no thermals): 32.2,109.4 37.9,109.4 37.9,113.4 32.2,113.4
ORD_!SHDN  (via drill 0.18)
  Top 0.18: U1.20 22.35,41.45 v21.3,42.5 | v16.2,62.61 v16.2,60.99
  Bottom 0.18: U301.P4 17.81,101.41 15.6,99.2 11.27,99.2 | 11.27,99.2 R304.1 | v21.3,42.5 20.5,41.7 19.26,41.7 16.48,44.48 16.48,48.92 15.7,49.7 15.7,52.9 16.6,53.8 16.6,59.7 16.2,60.1 v16.2,60.99 | 11.27,99.2 11.3,99.17 11.25,99.17 11,98.92 11,96 12,95 21,95 25,91 25,81 16,72 16,69 16.2,68.8 v16.2,62.61
ORDNANCE_POWER:N$1
  Bottom 0.18: U301.P1 19.31,100.89 19.78,100.42 C302.1
ORDNANCE_POWER:N$2
  Bottom 0.18: U301.P2 18.8,100.9 18.48,100.58 C302.2
ORDNANCE_POWER:N$3
  Bottom 0.254: U301.P10 21.89,103.76 C306.1 22.64,103.89 C305.1
  Bottom 1.016: C305.1 D301.2
  Bottom 1.27: D301.2 D301.1
ORDNANCE_POWER:N$4  (via drill 0.18)
  Top 0.18: D302.A 4.85,103.25 v4.9,103.2
  Bottom 0.18: 10.91,103.2 v4.9,103.2 | 10.91,103.2 C304.1 10.94,105.05 R302.1 | U301.P5 16.71,101.91 16.4,101.6 16.4,100.7 16.2,100.5 13.4,100.5 13.1,100.8 13.1,102.9 12.8,103.2 10.91,103.2
ORDNANCE_POWER:N$5
  Bottom 0.18: R301.1 17.31,106.47 U301.P6
ORDNANCE_POWER:N$6  (via drill 0.18)
  Top 0.18: v18,105 v16.6,105
  Bottom 0.18: U301.P7 17.8,104.4 18,104.6 v18,105 | v16.6,105 15.16,103.56 R303.2
ORDNANCE_POWER:N$7
  Bottom 0.254: U301.P3 18.31,101.21 17.34,100.24 C307.1 18.09,98.3 20.8,98.3 22.02,99.52 C306.2
RTD:N$1  (via drill 0.18)
  Top 0.18: R401.2 R402.2 R403.2 R404.2 19.6,16.18 v19.6,19.6
  Bottom 0.18: v19.6,19.6 20.57,19.6 U$401.1
RTD:N$4  (via drill 0.18)
  Top 0.18: R401.1 R402.1 21.86,13.44 | 21.86,13.44 R403.1 | v19.6,21.2 20.3,21.2 21,20.5 21,18.4 23,16.4 23,14.58 21.86,13.44
  Bottom 0.18: U$401.4 U$401.3 19.8,21 v19.6,21.2
RTD:N$5  (via drill 0.18)
  Top 0.18: R404.1 21.5,15.98 21.5,16 | 21.5,16 21.5,16.5 | 21.5,16 21.5,16.5 | 21.5,16.5 20.4,17.6 20.4,20.2 20.2,20.4 v19.6,20.4
  Bottom 0.18: U$401.2 20.62,20.4 v19.6,20.4
RTD_!CS  (via drill 0.18)
  Top 0.18: U1.18 24.5,37.9 27.3,37.9 27.7,37.5 v27.7,33.7
  Bottom 0.18: v27.7,33.7 26,32 26,26.6 29,23.6 29,22.2 27.8,21 U$401.13
RTD_MISO  (via drill 0.18)
  Top 0.18: U1.8 15.2,42.55 15.2,40.9 19.8,36.3 22.9,36.3 23.6,37 v25.2,37 | v28,23 28,21.4 v27,20.4
  Bottom 0.18: v25.2,37 25.2,26.2 28.1,23.3 28.1,23.1 v28,23 | v27,20.4 25.38,20.4 U$401.14
RTD_MOSI  (via drill 0.18)
  Top 0.18: v27,37.3 25.62,37.3 25.41,37.51 24.18,37.51 U1.17
  Bottom 0.18: v27,37.3 27,33.8 25.6,32.4 25.6,26.4 28.6,23.4 28.6,22.6 28.3,22.3 U$401.11
RTD_SCK  (via drill 0.18)
  Top 0.18: U1.22 23.08,42.12 24.5,40.7 24.5,39.2 25,38.7 27.7,38.7 28.5,37.9 28.5,34.5 28.7,34.3 28.7,32.9 v28.9,32.7 | v27,21.6 v27,26.6
  Bottom 0.18: v28.9,32.7 27.4,32.7 26.4,31.7 26.4,26.8 26.6,26.6 v27,26.6 | U$401.12 26.05,21.65 26.1,21.6 v27,21.6
UC_LED1
  Top 0.18: LED1.A 36.75,15.45 36.2,16 32.5,16 32.2,16.3 32.2,32.2 29.33,35.17 29.3,35.2 29.3,40.3 28.23,41.37 28.23,48.67 27.9,49 27.3,49 U1.33
UC_LED2
  Top 0.18: LED2.A 36.75,18.35 36.1,19 32.9,19 32.6,19.3 32.6,32.4 29.71,35.38 29.7,35.4 29.7,40.5 28.61,41.59 28.61,48.88 28.1,49.4 27,49.4 U1.34
UC_LED3
  Top 0.18: LED3.A 36.75,21.35 36.1,22 33.4,22 33,22.4 33,32.6 30.1,35.6 30.1,40.7 29,41.8 29,49.1 28.3,49.8 26.69,49.8 U1.35
UC_LED4
  Top 0.18: LED4.A 36.75,24.35 36.1,25 33.8,25 33.4,25.4 33.4,32.8 30.5,35.7 30.5,40.9 29.4,42 | U1.36 26.38,50.2 28.5,50.2 29.4,49.3 29.4,42 | 29.4,41.98 29.4,42
UC_LED5  (via drill 0.18)
  Top 0.18: LED5.A 36.75,27.25 35.9,28.1 34.4,28.1 33.8,28.7 33.8,31.5 v34,31.7 | v31.6,31.7 31.6,32.2 28.9,35 28.9,38.1 27.9,39.1 25.2,39.1 24.9,39.4 24.9,41.04 U1.23
  Bottom 0.18: v34,31.7 v31.6,31.7
USB_N  (via drill 0.18)
  Top 0.178: 12.8,68.59 13.32,68.59 13.71,68.98 13.71,70.8 v13.58,70.8
  Top 0.18: CN1.D- 10.09,68.8 10.3,68.59 12.8,68.59
  Bottom 0.178: v13.58,70.8 13.71,70.8 13.71,72.1 13.57,72.23 IC1601.16
USB_P  (via drill 0.18)
  Top 0.178: 12.8,68.21 13.48,68.21 14.09,68.82 14.09,70.8 v14.22,70.8
  Top 0.18: CN1.D+ 10.09,68 10.3,68.21 12.8,68.21
  Bottom 0.178: v14.22,70.8 14.09,70.8 14.09,72.1 14.22,72.23 IC1601.15
USB_RX  (via drill 0.18)
  Top 0.18: U1.37 25.22,49.72 26.9,51.4 26.9,56.9 24.1,59.7 9.9,59.7 v9,60.1 | v6.9,78.7 v9.2,78.7
  Bottom 0.18: v9,60.1 9,60.2 8.7,60.5 6.2,60.5 3.4,63.3 3.4,77.9 4.2,78.7 v6.9,78.7 | IC1601.5 8.38,79.53 v9.2,78.7
USB_TX  (via drill 0.18)
  Top 0.18: U1.38 24.84,50.14 26.5,51.8 26.5,56.6 23.8,59.3 9,59.3 v8.1,59.6
  Bottom 0.18: IC1601.1 5.42,80.62 3,78.2 3,63.1 6,60.1 7.6,60.1 v8.1,59.6
VCC_IN
  Top 0.406: D1.C 29.19,78.84 J1.1
  Bottom 0.406: J1.1 35.84,78.84 36.96,79.96 Q101.2
VDDOUT  (via drill 0.18)
  Top 0.254: U1.30 25.88,44.98 25.23,45.63 23.05,45.63 v21.65,46.03 | U1.45 22.34,52.55 21.69,51.9 20.88,51.9 v20,51.02 | U1.9 16.22,42.89 17.49,44.16 v17.49,44.19
  Bottom 0.18: 20,49.64 C3.2 | 20,49.64 19.96,49.6 | v20,51.02 20,49.64
  Bottom 0.254: C2.2 21.65,45.45 v21.65,46.03 20.75,47.15 19.6,48.4 19.43,48.57 | v17.49,44.19 17,44.68 17,46.78 18.79,48.57 19.43,48.57 | 19.43,48.57 20,49.13 20,49.64
XBEE_RX
  Top 0.18: U1.21 24.1,40.42 24.1,39 24.8,38.3 27.5,38.3 28.1,37.7 28.1,34.2 28.3,34 28.3,27.1 28.6,26.8 28.6,11.6 29.7,10.5 XB501.3
XBEE_TX  (via drill 0.18)
  Top 0.18: U1.51 16.99,53.9 15.9,53.9 13.1,56.7 v9.7,56.7 | v6.4,29.4 9.4,29.4 10.7,28.1 15.4,28.1 v16.8,26.7
  Bottom 0.18: XB501.2 22.2,8.5 18.8,11.9 18.8,24.7 v16.8,26.7 | v9.7,56.7 10,56.4 10,44 9,43 5,43 3.9,41.9 3.9,30.4 4.9,29.4 v6.4,29.4

## Text on the board
tPlace: CAP FULL | SWITCH | POWER | BW_2 | BW_1 | DROUGE | MAIN | SEP. | MOTOR | TEMP SENSOR